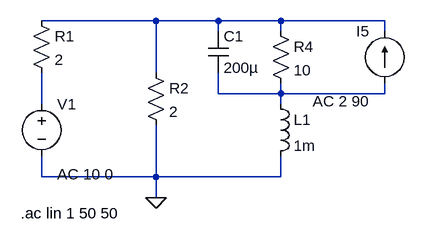
[diagram p0: schematic ac_single_frequency.asc]
ac_single_frequency.asc, the LTspice schematic file:
Version 4
SHEET 1 880 680
WIRE 112 0 -64 0
WIRE 208 0 112 0
WIRE 304 0 208 0
WIRE 464 0 304 0
WIRE 208 16 208 0
WIRE 304 16 304 0
WIRE 464 16 464 0
WIRE 112 80 112 0
WIRE 208 112 208 80
WIRE 304 112 304 96
WIRE 304 112 208 112
WIRE 464 112 464 96
WIRE 464 112 304 112
WIRE -64 128 -64 80
WIRE 304 128 304 112
WIRE -64 240 -64 208
WIRE 112 240 112 160
WIRE 112 240 -64 240
WIRE 304 240 304 208
WIRE 304 240 112 240
WIRE 112 272 112 240
FLAG 112 272 0
SYMBOL res -80 -16 R0
SYMATTR InstName R1
SYMATTR Value 2
SYMBOL res 96 64 R0
SYMATTR InstName R2
SYMATTR Value 2
SYMBOL res 288 0 R0
SYMATTR InstName R4
SYMATTR Value 10
SYMBOL cap 192 16 R0
SYMATTR InstName C1
SYMATTR Value 200µ
SYMATTR SpiceLine Rser=0 Lser=0
SYMBOL ind 288 112 R0
SYMATTR InstName L1
SYMATTR Value 1m
SYMATTR SpiceLine Rser=0
SYMBOL voltage -64 112 R0
WINDOW 123 24 124 Left 2
WINDOW 39 0 0 Left 2
SYMATTR InstName V1
SYMATTR Value ""
SYMATTR Value2 AC 10 0
SYMBOL current 464 96 R180
WINDOW 0 24 80 Left 2
WINDOW 3 24 0 Left 2
WINDOW 123 24 -28 Left 2
WINDOW 39 0 0 Left 2
SYMATTR InstName I5
SYMATTR Value ""
SYMATTR Value2 AC 2 90
TEXT -96 296 Left 2 !.ac lin 1 50 50

The netlist it stands for:
* ac_single_frequency.asc
R1 N001 N003 2
R2 N001 0 2
R4 N001 N002 10
C1 N001 N002 200µ Rser=0 Lser=0
L1 N002 0 1m Rser=0
V1 N003 0 AC 10 0
I5 N002 N001 AC 2 90
.ac lin 1 50 50
.backanno
.end